# Altium schematic sheet TC364_MainBoard_Power_V1.1.SchDoc
size A4
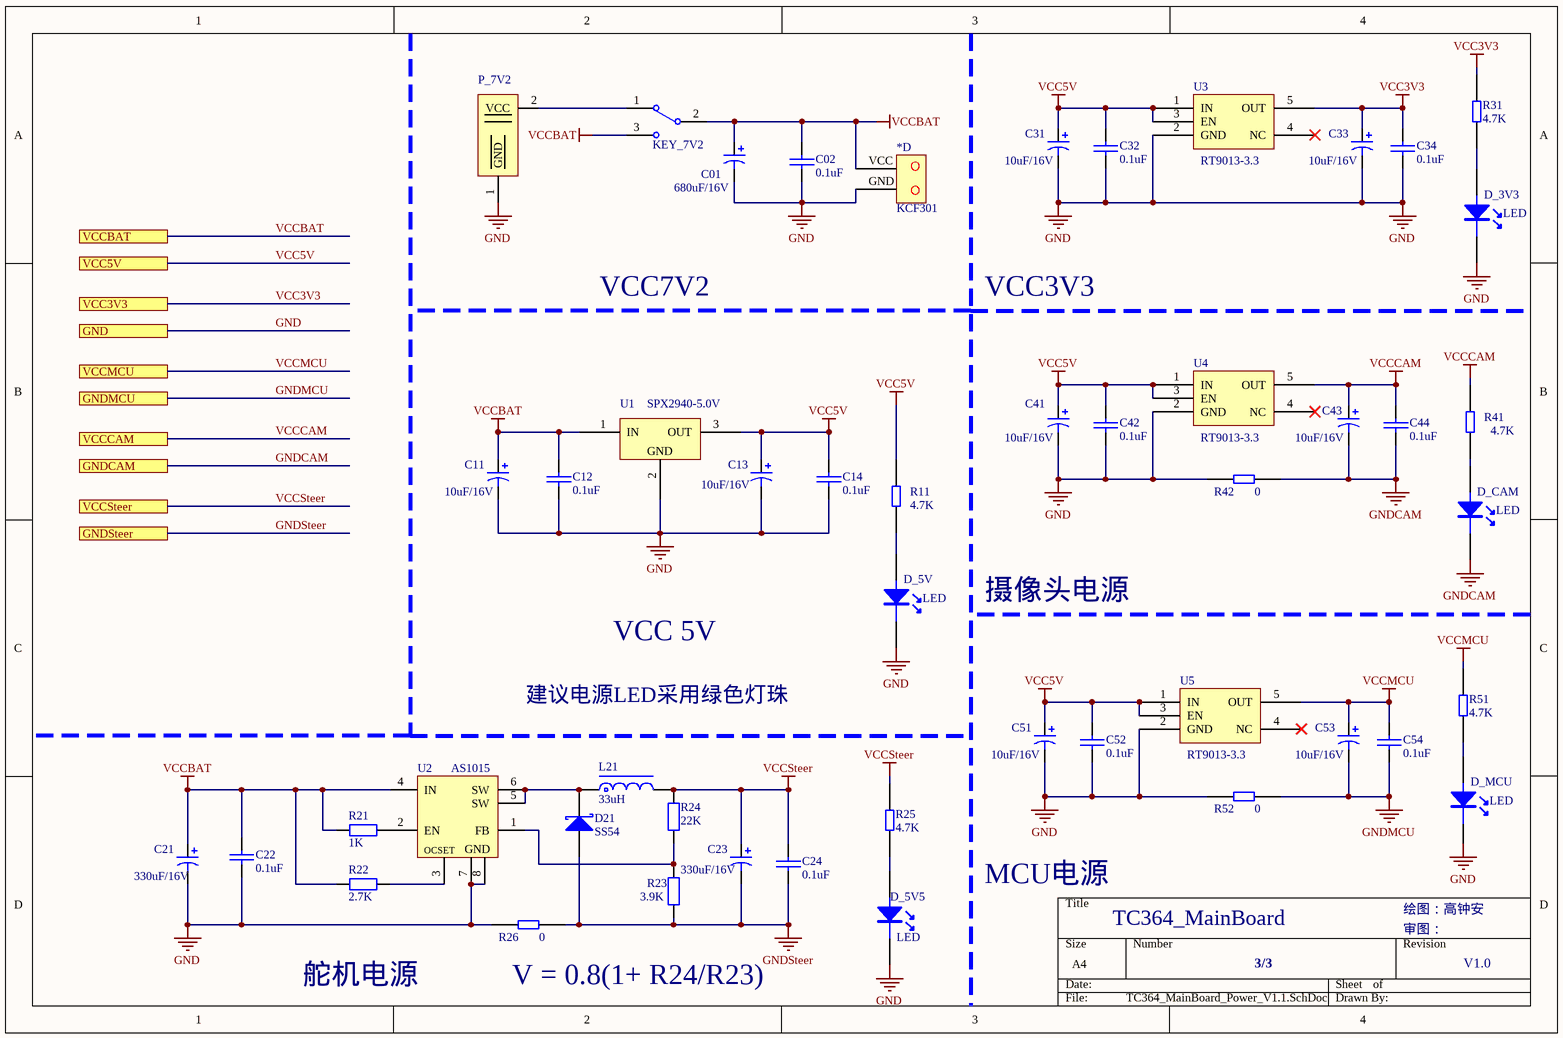
[diagram p0: TC364_MainBoard_Power_V1.1.SchDoc]

## Parts
*  KCF301  [KF301-2P]  (part D of 4)
C01  680uF/16V  [CAP 3.5*8*11.5 - GD]
C02  0.1uF  [0805C]
C11  10uF/16V  [CASE-A_3216]
C12  0.1uF  [0805C]
C13  10uF/16V  [CASE-A_3216]
C14  0.1uF  [0805C]
C21  330uF/16V  [CAP 2.5*6.3*11.2 - BK]
C22  0.1uF  [0805C]
C23  330uF/16V  [CAP 2.5*6.3*11.2 - BK]
C24  0.1uF  [0805C]
C31  10uF/16V  [CASE-A_3216]
C32  0.1uF  [0805C]
C33  10uF/16V  [CASE-A_3216]
C34  0.1uF  [0805C]
C41  10uF/16V  [CASE-A_3216]
C42  0.1uF  [0805C]
C43  10uF/16V  [CASE-A_3216]
C44  0.1uF  [0805C]
C51  10uF/16V  [CASE-A_3216]
C52  0.1uF  [0805C]
C53  10uF/16V  [CASE-A_3216]
C54  0.1uF  [0805C]
D21  SS54  [SMA]
D_3V3  LED  [0805_LED_S1]
D_5V  LED  [0805_LED_S1]
D_5V5  LED  [0805_LED_S1]
D_CAM  LED  [0805_LED_S1]
D_MCU  LED  [0805_LED_S1]
KEY_7V2  SS-12F23  [KEY_7V2]  (value not drawn)
L21  33uH  [7*7 L]
P_7V2  T_Type_Adapter  [T_Type_Adapter]  (value not drawn)
R11  4.7K  [0805R]
R21  1K  [0805R]
R22  2.7K  [0805R]
R23  3.9K  [0805R]
R24  22K  [0805R]
R25  4.7K  [0805R]
R26  0  [0805R]
R31  4.7K  [0805R]
R41  4.7K  [0805R]
R42  0  [0805R]
R51  4.7K  [0805R]
R52  0  [0805R]
U1  SPX2940-5.0V  [TO-220(TO-220-3)]
U2  AS1015  [SOP-8_150mil]
U3  RT9013-3.3  [SOT-23-5]
U4  RT9013-3.3  [SOT-23-5]
U5  RT9013-3.3  [SOT-23-5]

## Ports
GND, GNDCAM, GNDMCU, GNDSteer, VCC3V3, VCC5V, VCCBAT, VCCCAM, VCCMCU, VCCSteer

## Nets
GND: C01.2 C02.2 C11.2 C12.2 C13.2 C14.2 C21.2 C22.2 C31.2 C32.2 C33.2 C34.2 C41.2 C42.2 C51.2 C52.2 D_3V3.K D_5V.K D_5V5.K P_7V2.1(GND) R26.2 R42.2 R52.2 U1.2(GND) U2.7(GND) U2.8(GND) U3.2(GND) U4.2(GND) U5.2(GND) ; port GND
GNDCAM: C43.2 C44.2 D_CAM.K R42.1 ; port GNDCAM
GNDMCU: C53.2 C54.2 R52.1 ; port GNDMCU
GNDSteer: C23.2 C24.2 D21.1(A) R23.2 R26.1 ; port GNDSteer
VCC3V3: C33.1 C34.1 R31.1 U3.5(OUT) ; port VCC3V3
VCC5V: C13.1 C14.1 C31.1 C32.1 C41.1 C42.1 C51.1 C52.1 R11.1 U1.3(OUT) U3.1(IN) U3.3(EN) U4.1(IN) U4.3(EN) U5.1(IN) U5.3(EN) ; port VCC5V
VCCBAT: C01.1 C02.1 C11.1 C12.1 C21.1 C22.1 KEY_7V2.2 KEY_7V2.3 R21.2 R22.2 U1.1(IN) U2.4(IN) ; port VCCBAT
VCCCAM: C43.1 C44.1 R41.1 U4.5(OUT) ; port VCCCAM
VCCMCU: C53.1 C54.1 R51.1 U5.5(OUT) ; port VCCMCU
VCCSteer: C23.1 C24.1 L21.2 R24.1 R25.1 ; port VCCSteer
NetD21_2: D21.2(K) L21.1 U2.5(SW) U2.6(SW)
NetD_3V3_A: D_3V3.A R31.2
NetD_5V5_A: D_5V5.A R25.2
NetD_5V_A: D_5V.A R11.2
NetD_CAM_A: D_CAM.A R41.2
NetD_MCU_A: D_MCU.A R51.2
NetKEY_7V2_1: KEY_7V2.1 P_7V2.2(VCC)
NetR21_1: R21.1 U2.2(EN)
NetR22_1: R22.1 U2.3(OCSET)
NetR23_1: R23.1 R24.2 U2.1(FB)

Not connected (* = marked no-connect by the designer): * GND(1) VCC(0); D_MCU K(2); U3 4(NC)*; U4 4(NC)*; U5 4(NC)*

## Notes on the sheet
- VCC7V2
- VCC3V3
- VCC 5V
- 摄像头电源
- 建议电源LED采用绿色灯珠
- MCU电源
- TC364_MainBoard
- 绘图：高钟安
- 舵机电源
- V = 0.8(1+ R24/R23)
- 3/3
- 审图：
- V1.0
- Labels drawn without touching a wire or pin: GND

## Library data of the parts
C01 C11 C13 C21 C23 C31 C33 C41 C43 C51 C53 = Cap Pol1: Polarized Capacitor (Radial); Published: 8-Jun-2000; LatestRevisionDate: 17-Jul-2002; LatestRevisionNote: Re-released for DXP Platform.; PackageReference: RB7.6-15; Publisher: Altium Limited; PackageDescription: Polarized Capacitor (Radial); 2 Leads
C02 C12 C14 C22 C24 C32 C34 C42 C44 C52 C54 = CAP: Capacitor
D21 = SS34: 肖特基二极管; 属性: 40V/3A; BOM名称: 肖特基二极管; 封装库来自淘宝 ID：黄晶宝石: https://shop463601444.taobao.com
D_3V3 D_5V D_5V5 D_CAM D_MCU = LED: 发光二极管
KEY_7V2 = SSW-1P: 1路波动开关; BOM名称: 波动开关; 版权归属: 封装库来自淘宝 ID：黄晶宝石; 学习资源: www.ooocke.com
L21 = L-CDRH: 功率屏蔽电感; 版权归属: 封装库来自淘宝 ID：黄晶宝石; BOM名称: 功率屏蔽电感; 联系售后: https://shop463601444.taobao.com
R11 R25 R26 R31 R41 R42 R51 R52 = RES
R21-R24 = RES: 贴片电阻; 版权归属: 源创客; BOM名称: 贴片电阻; 学习资源: www.ooocke.com
U1 = LM2940: 5V稳压芯片; 版权归属: 封装库来自淘宝 ID：黄晶宝石; BOM名称: 5V稳压芯片; 联系售后: www.ooocke.com
U2 = AS1015: 可调升压芯片